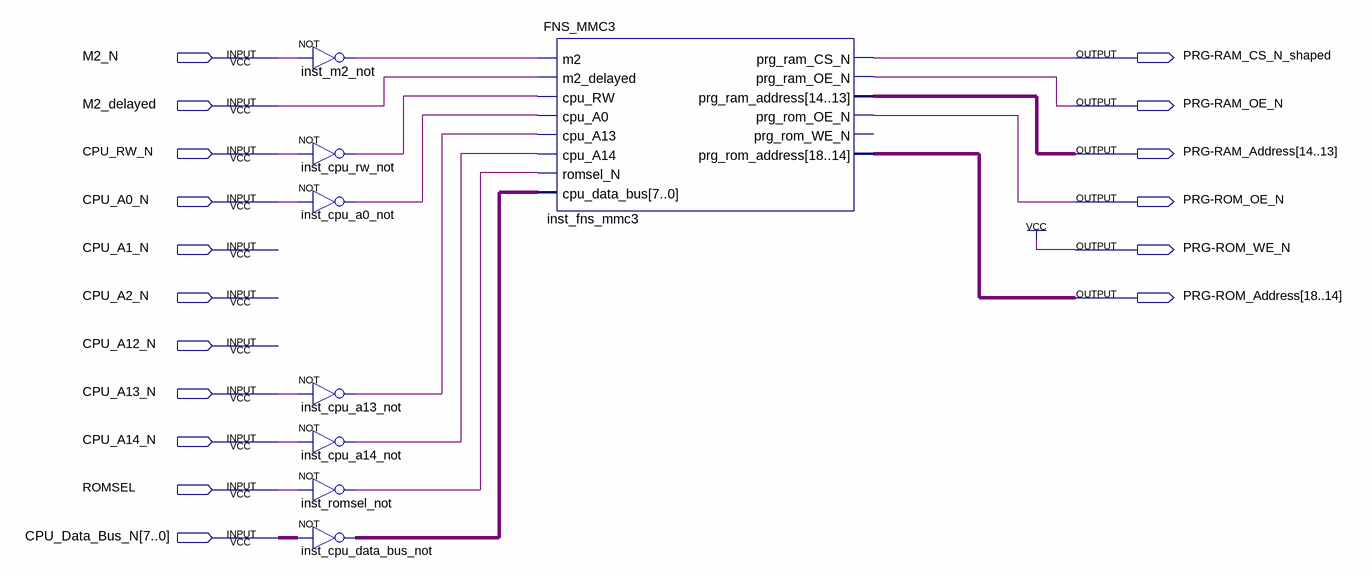
[diagram p0: schematic sheet]
// Quartus schematic boldt-mmc3.bdf as structural Verilog: 8 symbols, 17 pins
module \boldt-mmc3  (
  input  M2_N,
  input  M2_delayed,
  input  CPU_RW_N,
  input  CPU_A0_N,
  input  CPU_A1_N,
  input  CPU_A2_N,
  input  CPU_A12_N,
  input  CPU_A13_N,
  input  CPU_A14_N,
  input  ROMSEL,
  input  [7:0] CPU_Data_Bus_N,
  output \PRG-RAM_CS_N_shaped ,
  output \PRG-RAM_OE_N ,
  output [14:13] \PRG-RAM_Address ,
  output \PRG-ROM_OE_N ,
  output \PRG-ROM_WE_N ,
  output [18:14] \PRG-ROM_Address 
);

  wire inst_cpu_a0_not_out, inst_cpu_a13_not_out, inst_cpu_a14_not_out, inst_cpu_rw_not_out, inst_m2_not_out,
       inst_romsel_not_out;
  wire [7:0] inst_cpu_data_bus_not_out;

  not inst_m2_not (inst_m2_not_out, M2_N);
  not inst_cpu_rw_not (inst_cpu_rw_not_out, CPU_RW_N);
  not inst_cpu_a0_not (inst_cpu_a0_not_out, CPU_A0_N);
  not inst_cpu_a13_not (inst_cpu_a13_not_out, CPU_A13_N);
  not inst_cpu_a14_not (inst_cpu_a14_not_out, CPU_A14_N);
  not inst_romsel_not (inst_romsel_not_out, ROMSEL);
  assign inst_cpu_data_bus_not_out = ~CPU_Data_Bus_N;  // NOT inst_cpu_data_bus_not, 8 bits wide
  FNS_MMC3 inst_fns_mmc3 (
    .m2(inst_m2_not_out), .m2_delayed(M2_delayed), .cpu_RW(inst_cpu_rw_not_out),
    .cpu_A0(inst_cpu_a0_not_out), .cpu_A13(inst_cpu_a13_not_out), .cpu_A14(inst_cpu_a14_not_out),
    .romsel_N(inst_romsel_not_out), .cpu_data_bus(inst_cpu_data_bus_not_out),
    .prg_ram_CS_N(\PRG-RAM_CS_N_shaped ), .prg_ram_OE_N(\PRG-RAM_OE_N ), .prg_ram_address(\PRG-RAM_Address ),
    .prg_rom_OE_N(\PRG-ROM_OE_N ), .prg_rom_address(\PRG-ROM_Address ));  // open: prg_rom_WE_N

  assign \PRG-ROM_WE_N  = 1'b1;
endmodule
